# EAGLE schematic untitled (EAGLE 9.3.0)
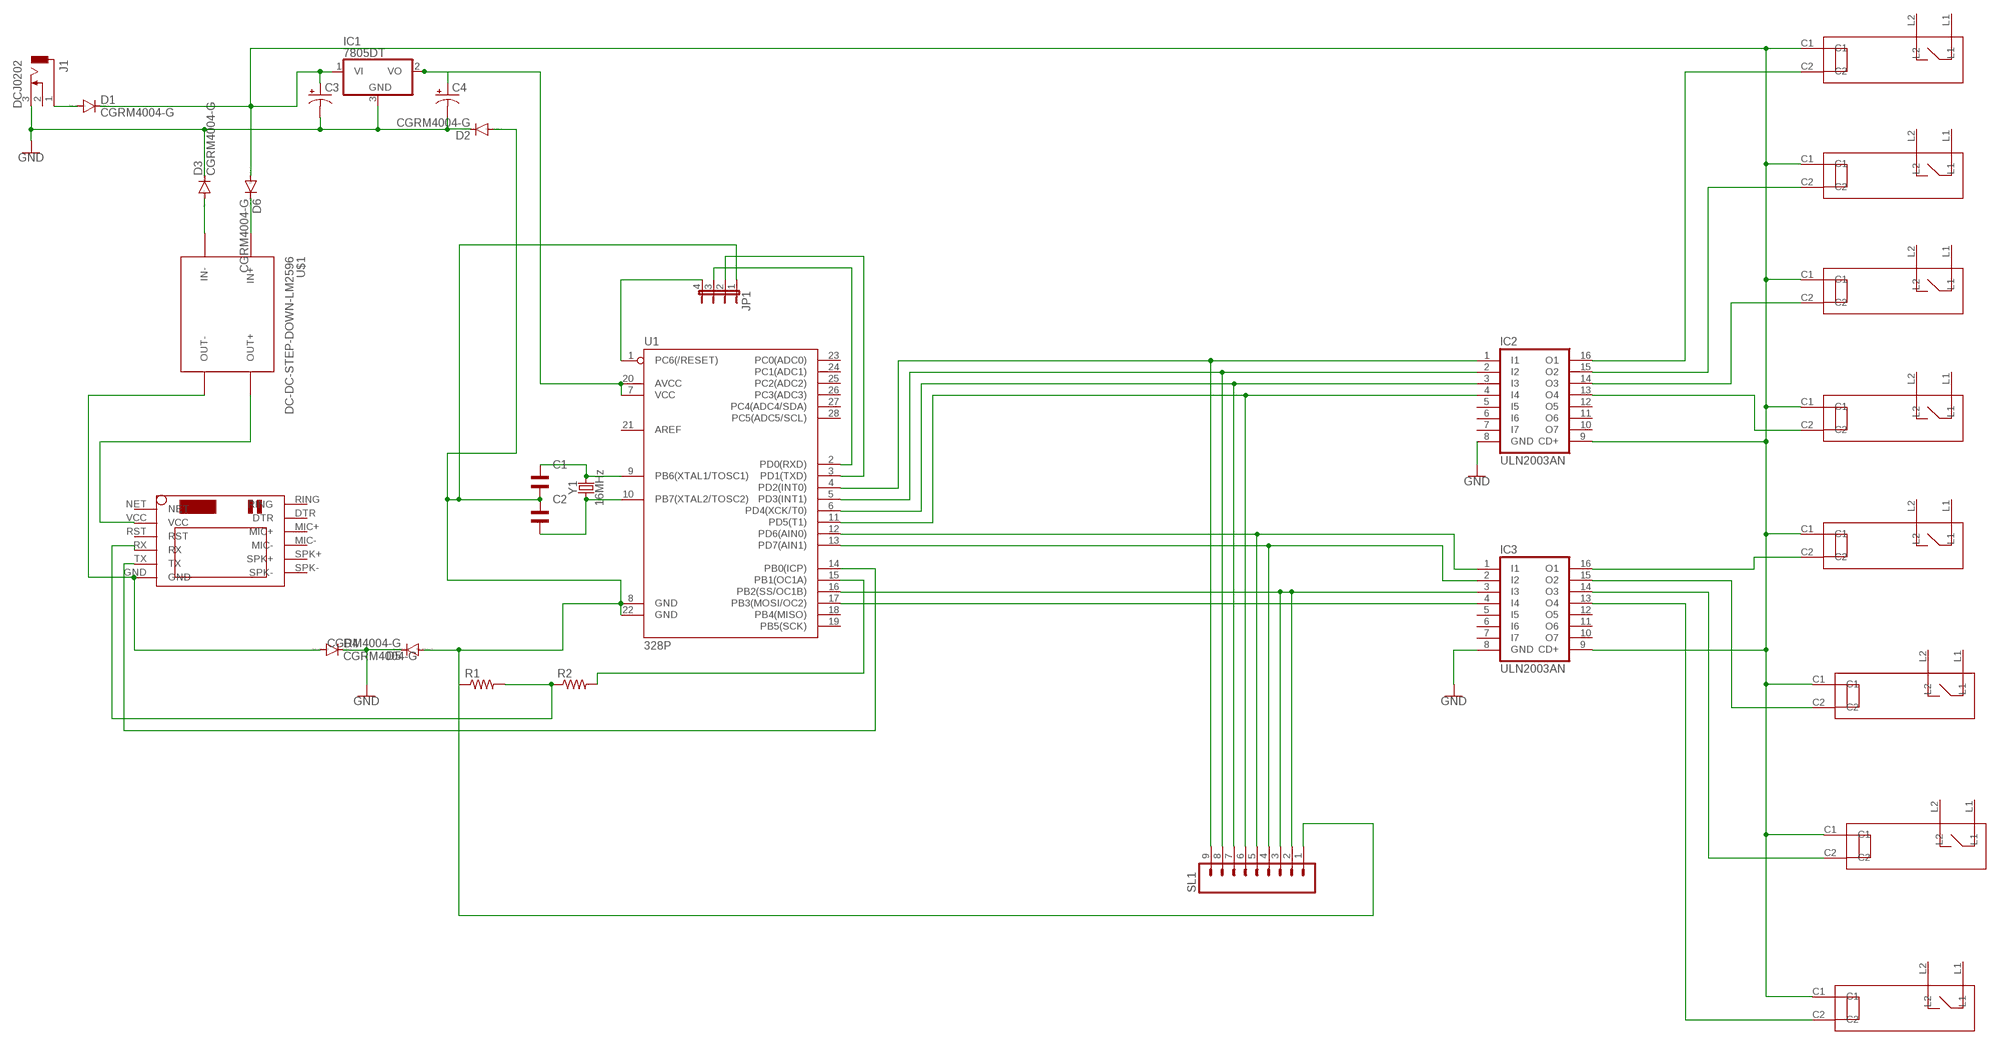
[diagram p0: schematic, sheet 1]

## Parts
C1  WCAP-CSGP_1206_885012008001  [WCAP-CSGP_1206]
C2  WCAP-CSGP_1206_885012008001  [WCAP-CSGP_1206]
C3  CPOL-USE3.5-8  [E3,5-8]
C4  CPOL-USE2.5-5  [E2,5-5]
D1  CGRM4004-G  [SOD-123_MINI-SMA]
D2  CGRM4004-G  [SOD-123_MINI-SMA]
D3  CGRM4004-G  [SOD-123_MINI-SMA]
D4  CGRM4004-G  [SOD-123_MINI-SMA]
D5  CGRM4004-G  [SOD-123_MINI-SMA]
D6  CGRM4004-G  [SOD-123_MINI-SMA]
IC1  7805DT  [TO252]
IC2  ULN2003AN  [DIL16]
IC3  ULN2003AN  [DIL16]
J1  DCJ0202  [DCJ0202]
JP1  JP4E  [JP4]
R1  R-US_R1206  [R1206]
R2  R-US_R1206  [R1206]
SL1  M09  [09P]
U1  328P  ATMEGA328P_PDIP  [DIP28]
U$1  DC-DC-STEP-DOWN-LM2596  [DC-DC-STEP-DOWN-LM2596]
U$2  SIM800LMODULE  [SIM800LMODULE]
U$3  HF46F  [HF46F]
U$4  HF46F  [HF46F]
U$5  HF46F  [HF46F]
U$6  HF46F  [HF46F]
U$7  HF46F  [HF46F]
U$8  HF46F  [HF46F]
U$9  HF46F  [HF46F]
U$10  HF46F  [HF46F]
Y1  16MHz  CRYSTAL-16MHZPTH-HC49US  [HC49US]

## Nets
GND: C3.- C4.- D2.C D3.C D4.C D5.C IC1.3(GND) IC2.8(GND) IC3.8(GND) J1.3
N$1: IC2.1(I1) SL1.9 U1.4(PD2(INT0))
N$2: C1.2 U1.9(PB6(XTAL1/TOSC1)) Y1.2
N$3: C2.1 U1.10(PB7(XTAL2/TOSC2)) Y1.1
N$4: C3.+ D1.C D6.A IC1.1(VI) IC2.9(CD+) IC3.9(CD+) U$3.C1 U$4.C1 U$5.C1 U$6.C1 U$7.C1 U$8.C1 U$9.C1 U$10.C1
N$5: C4.+ IC1.2(VO) U1.7(VCC) U1.20(AVCC)
N$6: D1.A J1.1
N$7: D3.A U$1.IN-
N$8: U1.14(PB0(ICP)) U$2.TX
N$9: U$1.OUT+ U$2.VCC
N$10: C1.1 C2.2 D2.A D5.A JP1.1 R1.1 SL1.1 U1.8(GND) U1.22(GND)
N$11: D4.A U$1.OUT- U$2.GND
N$12: R1.2 R2.1 U$2.RX
N$13: R2.2 U1.15(PB1(OC1A))
N$14: IC2.2(I2) SL1.8 U1.5(PD3(INT1))
N$15: IC2.3(I3) SL1.7 U1.6(PD4(XCK/T0))
N$16: IC2.4(I4) SL1.6 U1.11(PD5(T1))
N$17: IC3.1(I1) SL1.5 U1.12(PD6(AIN0))
N$18: IC3.2(I2) SL1.4 U1.13(PD7(AIN1))
N$19: IC3.3(I3) SL1.2 SL1.3 U1.16(PB2(SS/OC1B))
N$20: IC3.4(I4) U1.17(PB3(MOSI/OC2))
N$21: IC2.16(O1) U$3.C2
N$22: IC2.15(O2) U$4.C2
N$23: IC2.14(O3) U$5.C2
N$24: IC2.13(O4) U$6.C2
N$25: IC3.16(O1) U$7.C2
N$26: IC3.15(O2) U$8.C2
N$27: IC3.14(O3) U$9.C2
N$28: IC3.13(O4) U$10.C2
N$29: D6.C U$1.IN+
N$30: JP1.4 U1.1(PC6(/RESET))
N$31: JP1.3 U1.2(PD0(RXD))
N$32: JP1.2 U1.3(PD1(TXD))
Unconnected: IC2.5(I5) IC2.6(I6) IC2.7(I7) IC2.10(O7) IC2.11(O6) IC2.12(O5) IC3.5(I5) IC3.6(I6) IC3.7(I7) IC3.10(O7) IC3.11(O6) IC3.12(O5) J1.2 U1.18(PB4(MISO)) U1.19(PB5(SCK)) U1.21(AREF) U1.23(PC0(ADC0)) U1.24(PC1(ADC1)) U1.25(PC2(ADC2)) U1.26(PC3(ADC3)) U1.27(PC4(ADC4/SDA)) U1.28(PC5(ADC5/SCL)) U$2.DTR U$2.MIC+ U$2.MIC- U$2.NET U$2.RING U$2.RST U$2.SPK+ U$2.SPK- U$3.L1 U$3.L2 U$4.L1 U$4.L2 U$5.L1 U$5.L2 U$6.L1 U$6.L2 U$7.L1 U$7.L2 U$8.L1 U$8.L2 U$9.L1 U$9.L2 U$10.L1 U$10.L2

## Library data of the parts
C1 C2 = Wurth_Elektronik_Passive_Capacitors_rev18b:WCAP-CSGP_1206: WCAP-CSGP Ceramic Capacitors Characteristics Multilayer Ceramic Chip Capacitor Recommended soldering:Reflow, for 0603 and 0805 wave soldering is also allowed Operating temperature:-55 °C to +125 °C; Ceramic characteristics: Class I - NPO ; Class II -X7R, X5R High performance ceramic High capacitance stability Minimal aging Termination:Cu/Ni/Sn <http://katalog.we-online.de/media/images/eisos/WCAP-CSGP_pf2.jpg> Details see: http://katalog.we-online.de/en/pbs/WCAP-CSGP-1206? Created: 2015-01-28 2015 (C) Wurth Elektronik
C3 C4 = adafruit:CPOL-US: POLARIZED CAPACITOR, American symbol
D1-D6 = diode:CGRM400*-G: Molded plasitc,JEDEC SOD-123/Mini SMA Source: Comchip CGRM4001-G.pdf
IC1 = linear:78*: Positive VOLTAGE REGULATOR Source: http://cache.national.com/ds/LM/LM78L05.pdf http://www.fairchildsemi.com/ds/LM/LM7805.pdf
IC2 IC3 = uln-udn:ULN2003A: DRIVER ARRAY
J1 = con-jack:DCJ0202: DC POWER JACK Source: DCJ0202.pdf; OC_FARNELL: unknown; OC_NEWARK: unknown
JP1 = jumper:JP4E: JUMPER
R1 R2 = adafruit:R-US_: RESISTOR, American symbol
SL1 = con-amp-quick:M09: AMP QUICK CONNECTOR; OC_FARNELL: unknown; OC_NEWARK: unknown
U1 = SparkFun-IC-Microcontroller:ATMEGA328P_PDIP: Atmel 328P Through hole ATMEGA328P uC used in the Arduino 32kb flash, 1k EEPROM, 2k SRAM Datasheet <http://www.sparkfun.com/datasheets/Components/SMD/ATMega328.pdf> SparkFun Products Storefront component: AVR 28 Pin 20MHz 32K 6A/D - ATMega328P <https://www.sparkfun.com/products/9061> (COM-09061) SparkFun Simon Says - Through-Hole Soldering Kit <https://www.sparkfun.com/products/10547> (KIT-10547) SparkFun Learn to Solder - Simon Says <https://www.sparkfun.com/products/13708> (KIT-13708) SparkFun BigTime Watch Kit <https://www.sparkfun.com/products/11734> (KIT-11734) SparkFun ClockIt <https://www.sparkfun.com/products/10930> (KIT-10930) SparkFun Serial Enabled LCD Kit <https://www.sparkfun.com/products/10097> (LCD-10097) SparkFun Simon Tilts - Through Hole Soldering Kit <https://www.sparkfun.com/products/12634> (KIT-12634) SparkFun Frequency Counter Kit <https://www.sparkfun.com/products/10140> (KIT-10140) FabFM Radio Kit <https://www.sparkfun.com/products/11043> (KIT-11043) SparkFun Binary Blaster Kit <https://www.sparkfun.com/products/12037> (KIT-12037) SparkFun Metro-Gnome <https://www.sparkfun.com/products/9236> (KIT-09236) ATmega328 with Arduino Optiboot (Uno) <https://www.sparkfun.com/products/10524> (DEV-10524); PROD_ID: IC-09136
U$1 = diy-modules:DC-DC-STEP-DOWN-LM2596: DC/DC Step-Down Regulator based on LM2596-ADJ chip LM2596 datasheet available here: http://www.ti.com/lit/ds/symlink/lm2596.pdf Click here to find device on ebay.com <http://www.ebay.com/sch/lm2596+power+regulator>
U$2 = SIM800LMODULE:SIM800LMODULE: SIM800L Module
U$3-U$10 = HF46F:HF46F
Y1 = SparkFun-Clocks:CRYSTAL-16MHZ: 16MHz Crystal Digikey Example <http://www.digikey.com/product-search/en?keywords=535-9122-1-ND> Frequency: 16MHz Frequency Stability: ±50ppm Frequency Tolerance: ±20ppm Load Capacitance: 18pF SparkFun Products: Pro Micro -5V/16MHz <https://www.sparkfun.com/products/12640> SparkFun Serial Enabled LCD Kit <https://www.sparkfun.com/products/10097>; PROD_ID: XTAL-08181; SF_ID: COM-00536